# Altium schematic sheet 02-POWER DC-DC.SchDoc
size A4; SheetNumber: 3; SheetTotal: 6; SPICEModelCacheXRWPUVAV: <root> / <DocumentId>XRWPUVAV</DocumentId> / </root>
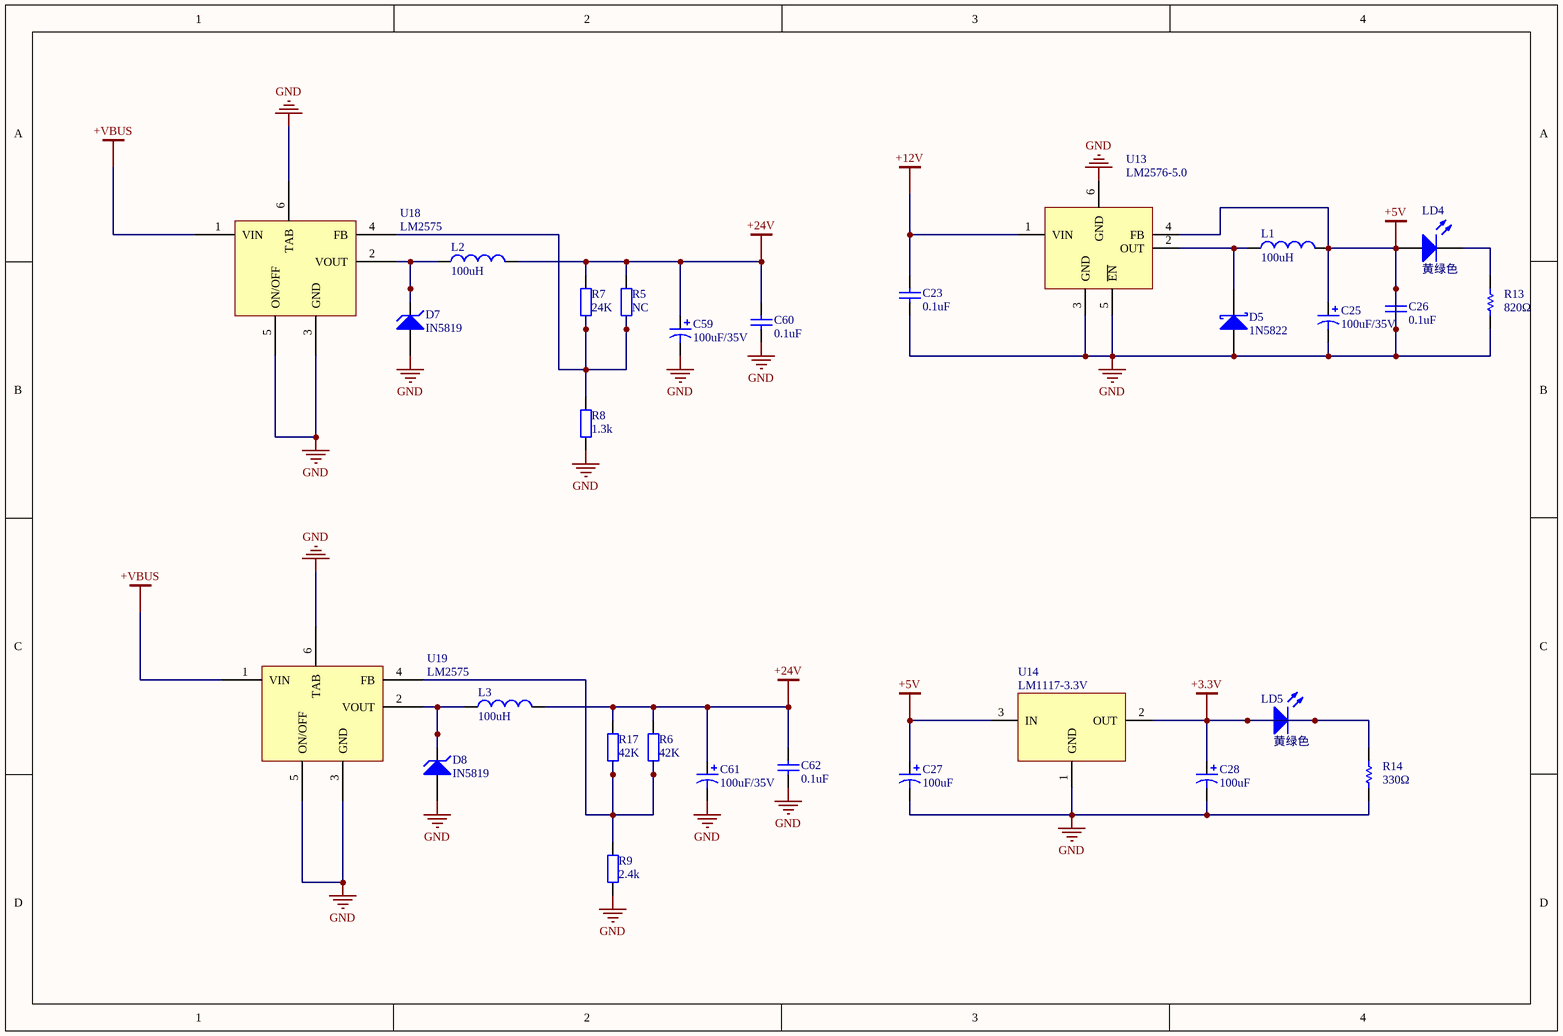
[diagram p0: 02-POWER DC-DC.SchDoc]

## Parts
C23  value 0.1uF  [C0805]  (hidden comment: Cap)
C25  value 100uF/35V  [SMD-6.3-7.7]  (hidden comment: Cap Pol2)
C26  value 0.1uF  [C0805]  (hidden comment: Cap)
C27  value 100uF  [SMD-6.3-7.7]  (hidden comment: Cap Pol2)
C28  value 100uF  [SMD-6.3-7.7]  (hidden comment: Cap Pol2)
C59  value 100uF/35V  [SMD-6.3-7.7]  (hidden comment: Cap Pol2)
C60  value 0.1uF  [C0805]  (hidden comment: Cap)
C61  value 100uF/35V  [SMD-6.3-7.7]  (hidden comment: Cap Pol2)
C62  value 0.1uF  [C0805]  (hidden comment: Cap)
D5  1N5822  [SMA-L4]
D7  IN5819  [SMA-L4]
D8  IN5819  [SMA-L4]
L1  value 100uH  [L100uH]  (hidden comment: Inductor)
L2  value 100uH  [L100uH]  (hidden comment: Inductor)
L3  value 100uH  [L100uH]  (hidden comment: Inductor)
LD4  黄绿色  [LED0805]
LD5  黄绿色  [LED0805]
R5  value NC  [R0805]  (hidden comment: Res2)
R6  value 42K  [R0805]  (hidden comment: Res2)
R7  value 24K  [R0805]  (hidden comment: Res2)
R8  value 1.3k  [R0805]  (hidden comment: Res2)
R9  value 2.4k  [R0805]  (hidden comment: Res2)
R13  value 820Ω  [NTC-10D9]
R14  value 330Ω  [NTC-10D9]
R17  value 42K  [R0805]  (hidden comment: Res2)
U13  LM2576-5.0  [TO-263-5]
U14  LM1117-3.3V  [SOT-223]
U18  LM2575  [TO-263-5]
U19  LM2575  [TO-263-5]

## Nets
+3.3V: C28.1 LD5.1(A) LD5.2(K) R14.2 U14.2(OUT)
+5V: C23.1 C25.1 C25.2 C26.1 C26.2 C27.1 C27.2 C28.2 C59.2 C60.1 C61.2 C62.1 D5.2(A) D7.1(A) D8.1(A) L1.2 LD4.1(A) R8.2 R9.2 R13.1 R14.1 U13.3(GND) U13.4(FB) U13.5(~{EN}) U13.6(GND) U14.1(GND) U14.3(IN) U18.3(GND) U18.5(ON/OFF) U18.6(TAB) U19.3(GND) U19.5(ON/OFF) U19.6(TAB)  [also labelled GND]
+12V: C23.2 U13.1(VIN)
+24V: C59.1 C60.2 C61.1 C62.2 L2.2 L3.2 R5.1 R6.1 R7.2 R17.2
+VBUS: U18.1(VIN) U19.1(VIN)
NetD5_1: D5.1(K) L1.1 U13.2(OUT)
NetD7_2: D7.2(K) L2.1 U18.2(VOUT)
NetD8_2: D8.2(K) L3.1 U19.2(VOUT)
NetLD4_2: LD4.2(K) R13.2
NetR5_2: R5.2 R7.1 R8.1 U18.4(FB)
NetR6_2: R6.2 R9.1 R17.1 U19.4(FB)

## Library data of the parts
C23 C26 C60 C62 = Cap: Capacitor; Published: 8-Jun-2000; LatestRevisionDate: 17-Jul-2002; LatestRevisionNote: Re-released for DXP Platform.; Publisher: Altium Limited
C25 C27 C28 C59 C61 = Cap Pol2: Polarized Capacitor (Axial); Published: 8-Jun-2000; LatestRevisionDate: 17-Jul-2002; LatestRevisionNote: Re-released for DXP Platform.; PackageReference: POLAR0.8; Publisher: Altium Limited; PackageDescription: Polarized Capacitor; 2 Leads
D5 = Diode 10TQ035: Schottky Rectifier; Note: Terminal 2 is the TAB and is electrically connected to the cathode; Published: 8-Jun-2000; LatestRevisionDate: 17-Jul-2002; LatestRevisionNote: Re-released for DXP Platform.; DatasheetDocument: PD-2.057B; PackageDocument: Feb-1998; PackageReference: TO-220AC; Publisher: Altium Limited
D7 D8 = D Zener: Zener Diode; Published: 8-Jun-2000; LatestRevisionDate: 17-Jul-2002; LatestRevisionNote: Re-released for DXP Platform.; PackageReference: DIODE-0.7; Publisher: Altium Limited; PackageDescription: Diode, Thru-Hole; 2 Leads; 0.7 in Pin Spacing
L1-L3 = Inductor: Code_IEC: 1005; Published: 8-Jun-2000; LatestRevisionDate: 17-Jul-2002; LatestRevisionNote: Re-released for DXP Platform.; PackageReference: 0402-A; Publisher: Altium Limited; Code_JEITA: 0402
LD4 LD5 = LED0: Typical INFRARED GaAs LED; Published: 8-Jun-2000; LatestRevisionDate: 17-Jul-2002; LatestRevisionNote: Re-released for DXP Platform.; Publisher: Altium Limited
R5-R9 R17 = Res2: Resistor; Published: 8-Jun-2000; LatestRevisionDate: 17-Jul-2002; LatestRevisionNote: Re-released for DXP Platform.; PackageReference: AXIAL-0.4; Publisher: Altium Limited; PackageDescription: Axial Device, Thru-Hole; 2 Leads; 0.4 in Pin Spacing
R13 R14 = Res1: Resistor; Published: 8-Jun-2000; LatestRevisionDate: 17-Jul-2002; LatestRevisionNote: Re-released for DXP Platform.; Publisher: Altium Limited
U14 = LM1117